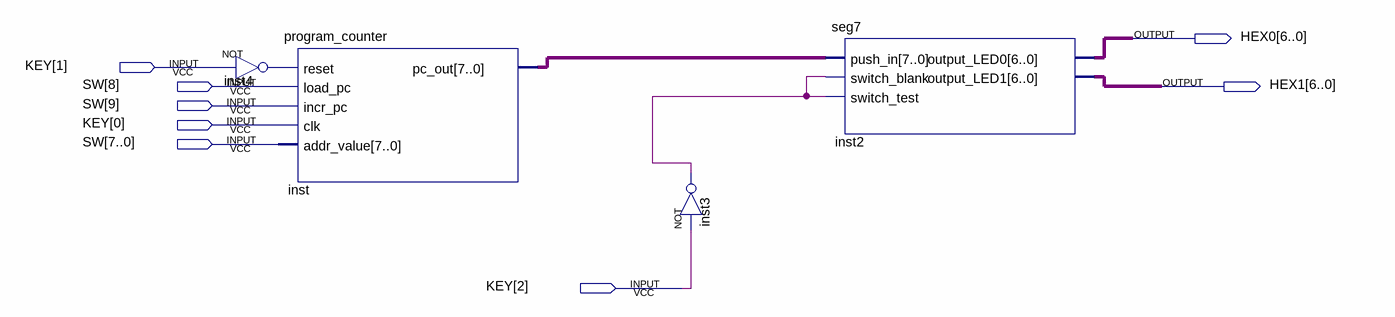
[diagram p0: schematic sheet]
// Quartus schematic pc_tb.bdf as structural Verilog: 4 symbols, 8 pins
module pc_tb (
  input  [2:0] KEY,
  input  [9:0] SW,
  output [6:0] HEX0,
  output [6:0] HEX1
);

  wire inst3_out, inst4_out;
  wire [7:0] inst_pc_out;

  not inst4 (inst4_out, KEY[1]);
  program_counter inst (
    .reset(inst4_out), .load_pc(SW[8]), .incr_pc(SW[9]), .clk(KEY[0]), .addr_value(SW[7:0]),
    .pc_out(inst_pc_out));
  not inst3 (inst3_out, KEY[2]);
  seg7 inst2 (
    .push_in(inst_pc_out), .switch_blank(inst3_out), .switch_test(inst3_out), .output_LED0(HEX0),
    .output_LED1(HEX1));
endmodule
